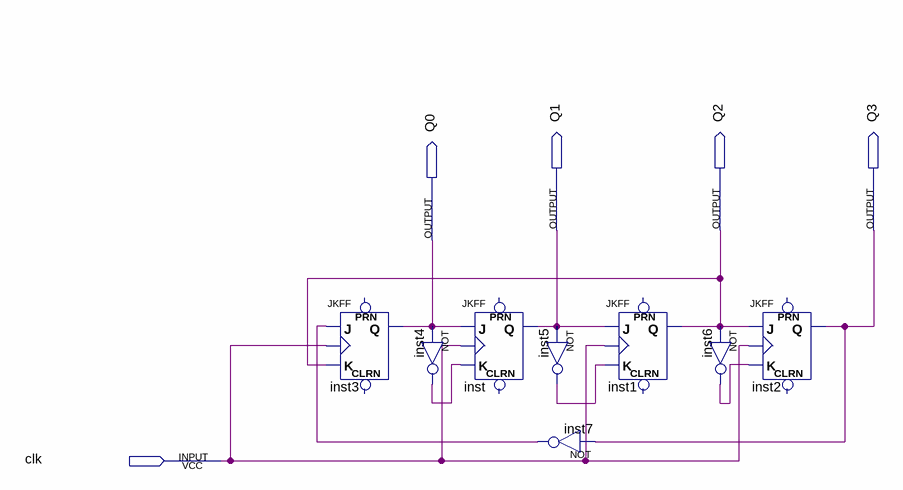
[diagram p0: schematic sheet]
// Quartus schematic HW10.bdf as structural Verilog: 8 symbols, 5 pins
module HW10 (
  input  clk,
  output Q1,
  output Q2,
  output Q3,
  output Q0
);

  wire inst4_out, inst5_out, inst6_out, inst7_out;

  JKFF inst3 (.K(Q2), .J(inst7_out), .CLK(clk), .Q(Q0));  // open: PRN, CLRN
  not inst4 (inst4_out, Q0);
  JKFF inst (.K(inst4_out), .J(Q0), .CLK(clk), .Q(Q1));  // open: PRN, CLRN
  not inst5 (inst5_out, Q1);
  not inst7 (inst7_out, Q3);
  JKFF inst1 (.K(inst5_out), .J(Q1), .CLK(clk), .Q(Q2));  // open: PRN, CLRN
  JKFF inst2 (.K(inst6_out), .J(Q2), .CLK(clk), .Q(Q3));  // open: PRN, CLRN
  not inst6 (inst6_out, Q2);
endmodule
